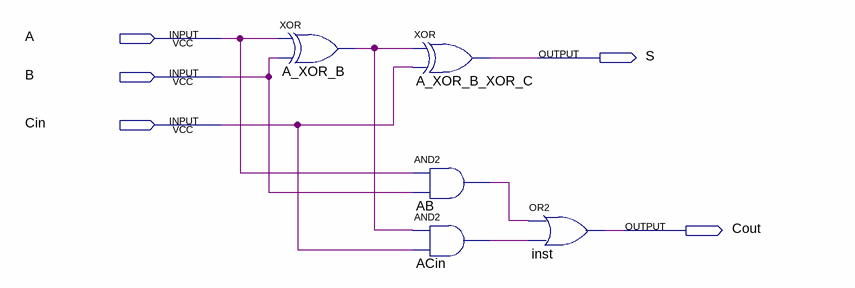
[diagram p0: schematic sheet]
// Quartus schematic Question1alt.bdf as structural Verilog: 5 symbols, 5 pins
module Question1alt (
  input  A,
  input  B,
  input  Cin,
  output S,
  output Cout
);

  wire A_XOR_B_out, AB_out, ACin_out;

  xor A_XOR_B (A_XOR_B_out, A, B);
  xor A_XOR_B_XOR_C (S, A_XOR_B_out, Cin);
  and AB (AB_out, A, B);
  and ACin (ACin_out, A_XOR_B_out, Cin);
  or inst (Cout, AB_out, ACin_out);
endmodule
